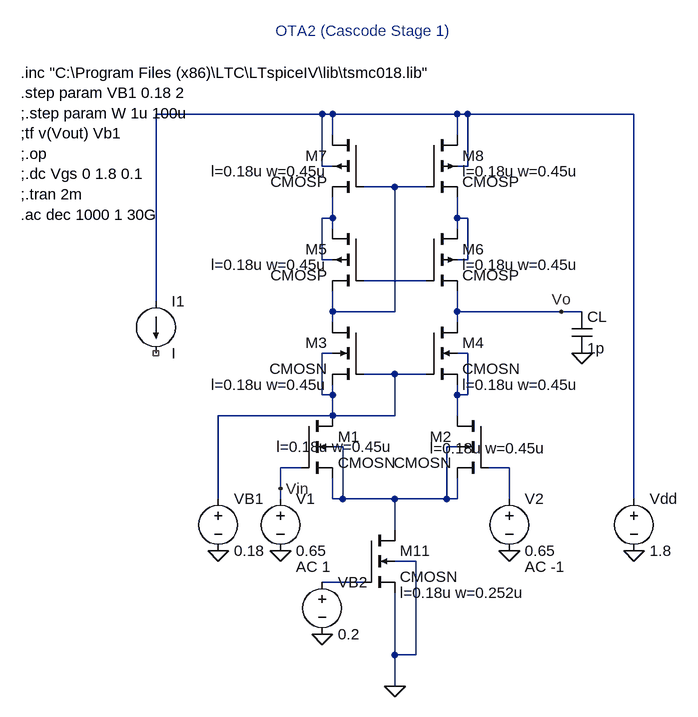
[diagram p0: schematic cascodefirst.asc]
cascodefirst.asc, the LTspice schematic file:
Version 4
SHEET 1 2552 708
WIRE 528 -192 272 -192
WIRE 544 -192 528 -192
WIRE 736 -192 544 -192
WIRE 752 -192 736 -192
WIRE 1008 -192 752 -192
WIRE 544 -160 544 -192
WIRE 736 -160 736 -192
WIRE 528 -112 528 -192
WIRE 544 -112 528 -112
WIRE 752 -112 752 -192
WIRE 752 -112 736 -112
WIRE 640 -80 592 -80
WIRE 688 -80 640 -80
WIRE 544 -32 544 -64
WIRE 544 -32 528 -32
WIRE 736 -32 736 -64
WIRE 752 -32 736 -32
WIRE 544 -16 544 -32
WIRE 736 -16 736 -32
WIRE 528 32 528 -32
WIRE 544 32 528 32
WIRE 752 32 752 -32
WIRE 752 32 736 32
WIRE 688 64 592 64
WIRE 272 96 272 -192
WIRE 544 112 544 80
WIRE 640 112 640 -80
WIRE 640 112 544 112
WIRE 736 112 736 80
WIRE 896 112 736 112
WIRE 928 112 896 112
WIRE 544 128 544 112
WIRE 736 128 736 112
WIRE 544 176 528 176
WIRE 752 176 736 176
WIRE 640 208 592 208
WIRE 688 208 640 208
WIRE 528 240 528 176
WIRE 544 240 544 224
WIRE 544 240 528 240
WIRE 736 240 736 224
WIRE 752 240 752 176
WIRE 752 240 736 240
WIRE 544 272 544 240
WIRE 544 272 368 272
WIRE 640 272 640 208
WIRE 640 272 544 272
WIRE 736 272 736 240
WIRE 560 320 544 320
WIRE 736 320 720 320
WIRE 496 352 464 352
WIRE 816 352 784 352
WIRE 464 384 464 352
WIRE 368 400 368 272
WIRE 464 400 464 384
WIRE 544 400 544 368
WIRE 560 400 560 320
WIRE 560 400 544 400
WIRE 640 400 560 400
WIRE 720 400 720 320
WIRE 720 400 640 400
WIRE 736 400 736 368
WIRE 736 400 720 400
WIRE 816 400 816 352
WIRE 1008 400 1008 -192
WIRE 640 448 640 400
WIRE 672 496 640 496
WIRE 592 528 528 528
WIRE 640 640 640 544
WIRE 672 640 672 496
WIRE 672 640 640 640
WIRE 640 688 640 640
FLAG 1008 480 0
FLAG 640 688 0
FLAG 528 608 0
FLAG 368 480 0
FLAG 464 480 0
FLAG 816 480 0
FLAG 928 176 0
FLAG 896 112 Vo
FLAG 464 384 Vin
SYMBOL voltage 1008 384 R0
WINDOW 123 0 0 Left 2
WINDOW 39 0 0 Left 2
SYMATTR InstName Vdd
SYMATTR Value 1.8
SYMBOL cmosn 496 272 R0
WINDOW 123 -38 48 Left 2
SYMATTR Value2 l=0.18u w=0.45u
SYMATTR InstName M1
SYMBOL cmosn 784 272 M0
WINDOW 123 -89 50 Left 2
SYMATTR Value2 l=0.18u w=0.45u
SYMATTR InstName M2
SYMBOL cmosn 592 128 M0
WINDOW 123 56 96 Left 2
SYMATTR Value2 l=0.18u w=0.45u
SYMATTR InstName M3
SYMBOL cmosn 688 128 R0
WINDOW 123 56 96 Left 2
SYMATTR Value2 l=0.18u w=0.45u
SYMATTR InstName M4
SYMBOL cmosp 688 -16 R0
WINDOW 123 56 56 Left 2
SYMATTR Value2 l=0.18u w=0.45u
SYMATTR InstName M6
SYMBOL cmosp 592 -16 M0
WINDOW 123 56 56 Left 2
SYMATTR Value2 l=0.18u w=0.45u
SYMATTR InstName M5
SYMBOL cmosp 592 -160 M0
WINDOW 123 56 56 Left 2
SYMATTR Value2 l=0.18u w=0.45u
SYMATTR InstName M7
SYMBOL cmosp 688 -160 R0
WINDOW 123 56 56 Left 2
SYMATTR Value2 l=0.18u w=0.45u
SYMATTR InstName M8
SYMBOL cmosn 592 448 R0
WINDOW 123 56 96 Left 2
SYMATTR Value2 l=0.18u w=0.252u
SYMATTR InstName M11
SYMBOL voltage 528 512 R0
WINDOW 123 0 0 Left 2
WINDOW 39 0 0 Left 2
SYMATTR InstName VB2
SYMATTR Value 0.2
SYMBOL voltage 368 384 R0
WINDOW 123 0 0 Left 2
WINDOW 39 0 0 Left 2
SYMATTR InstName VB1
SYMATTR Value 0.18
SYMBOL voltage 464 384 R0
WINDOW 123 24 120 Left 2
WINDOW 39 0 0 Left 2
SYMATTR Value2 AC 1
SYMATTR InstName V1
SYMATTR Value 0.65
SYMBOL voltage 816 384 R0
WINDOW 123 24 120 Left 2
WINDOW 39 0 0 Left 2
SYMATTR Value2 AC -1
SYMATTR InstName V2
SYMATTR Value 0.65
SYMBOL cap 912 112 R0
SYMATTR InstName CL
SYMATTR Value 1p
SYMBOL current 272 96 R0
SYMATTR InstName I1
TEXT 456 -320 Left 2 ;OTA2 (Cascode Stage 1)
TEXT 64 -256 Left 2 !.inc "C:\\Program Files (x86)\\LTC\\LTspiceIV\\lib\\tsmc018.lib"\n.step param VB1 0.18 2\n;.step param W 1u 100u\n;tf v(Vout) Vb1\n;.op\n;.dc Vgs 0 1.8 0.1\n;.tran 2m\n.ac dec 1000 1 30G

The netlist it stands for:
* cascodefirst.asc
Vdd N001 0 1.8
M1 N006 Vin N008 N008 CMOSN l=0.18u w=0.45u
M2 N007 N009 N008 N008 CMOSN l=0.18u w=0.45u
M3 N002 N006 N006 N006 CMOSN l=0.18u w=0.45u
M4 Vo N006 N007 N007 CMOSN l=0.18u w=0.45u
M6 N004 N005 Vo N004 CMOSP l=0.18u w=0.45u
M5 N003 N005 N002 N003 CMOSP l=0.18u w=0.45u
M7 N001 N002 N003 N001 CMOSP l=0.18u w=0.45u
M8 N001 N002 N004 N001 CMOSP l=0.18u w=0.45u
M11 N008 N010 0 0 CMOSN l=0.18u w=0.252u
VB2 N010 0 0.2
VB1 N006 0 0.18
V1 Vin 0 0.65 AC 1
V2 N009 0 0.65 AC -1
CL Vo 0 1p
I1 N001 NC_01 I
.model NMOS NMOS
.model PMOS PMOS
.lib standard.mos
* OTA2 (Cascode Stage 1)
.inc "C:\Program Files (x86)\LTC\LTspiceIV\lib\tsmc018.lib"
.step param VB1 0.18 2
;.step param W 1u 100u
;tf v(Vout) Vb1
;.op
;.dc Vgs 0 1.8 0.1
;.tran 2m
.ac dec 1000 1 30G
.backanno
.end